# Altium schematic sheet Main.SchDoc
size A; SheetNumber: 1; SheetTotal: 5
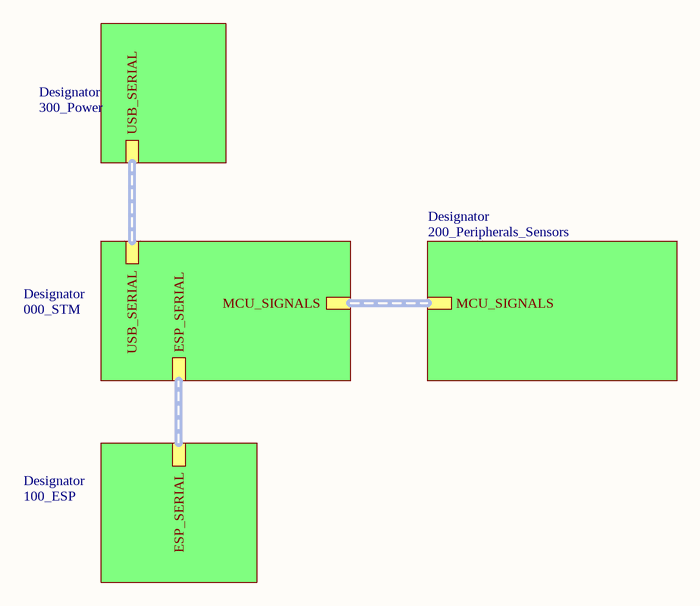
[diagram p0: Main.SchDoc]

## Sub-sheets
Designator = 000_STM: MCU_SIGNALS (harness MCU_SIGNALS), USB_SERIAL (harness USB_SERIAL), ESP_SERIAL (harness ESP_SERIAL)
Designator = 100_ESP: ESP_SERIAL (harness ESP_SERIAL)
Designator = 200_Peripherals_Sensors: MCU_SIGNALS (harness MCU_SIGNALS)
Designator = 300_Power: USB_SERIAL (harness USB_SERIAL)